# EAGLE board stm32_03.2 (EAGLE 9.5.1)
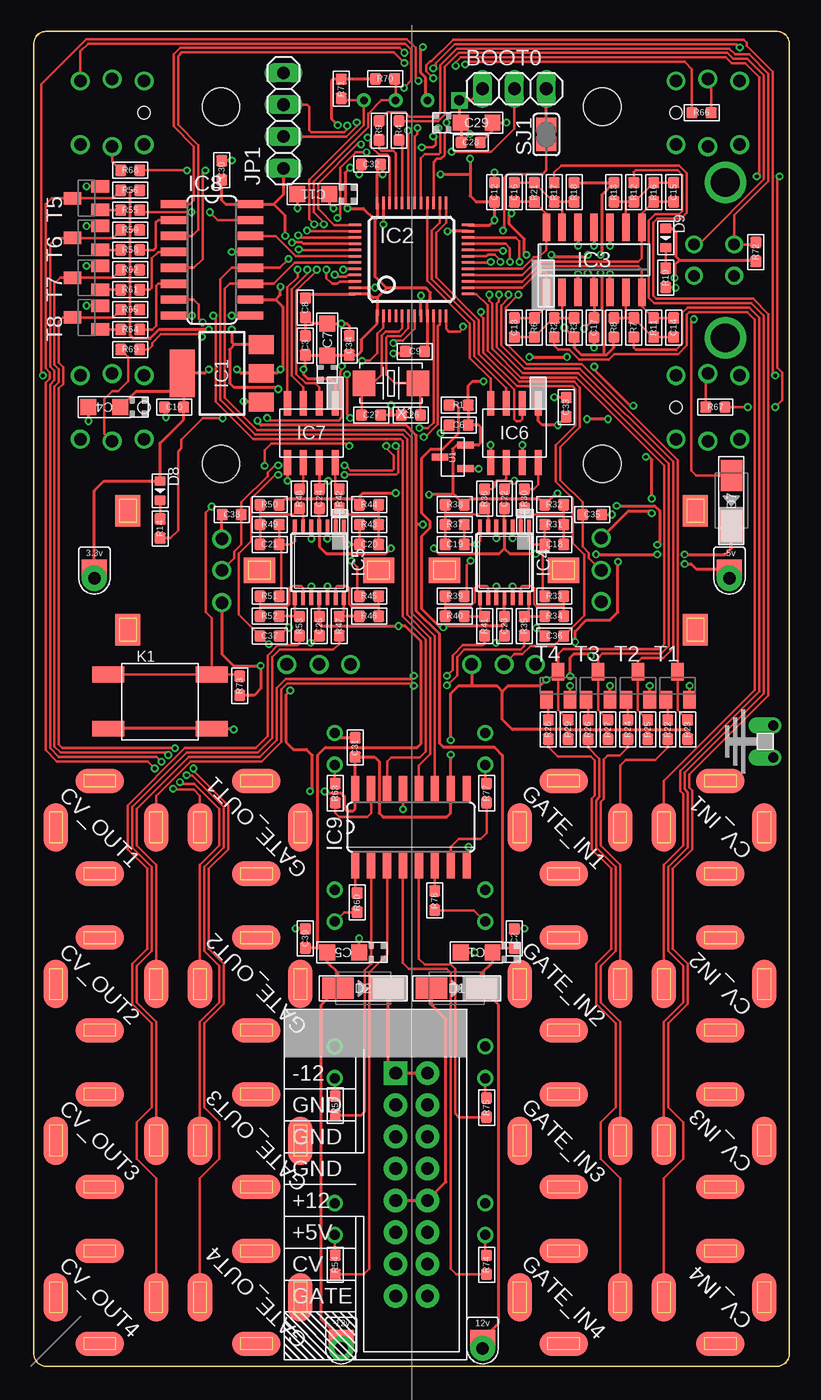
[diagram p4: board, top side]
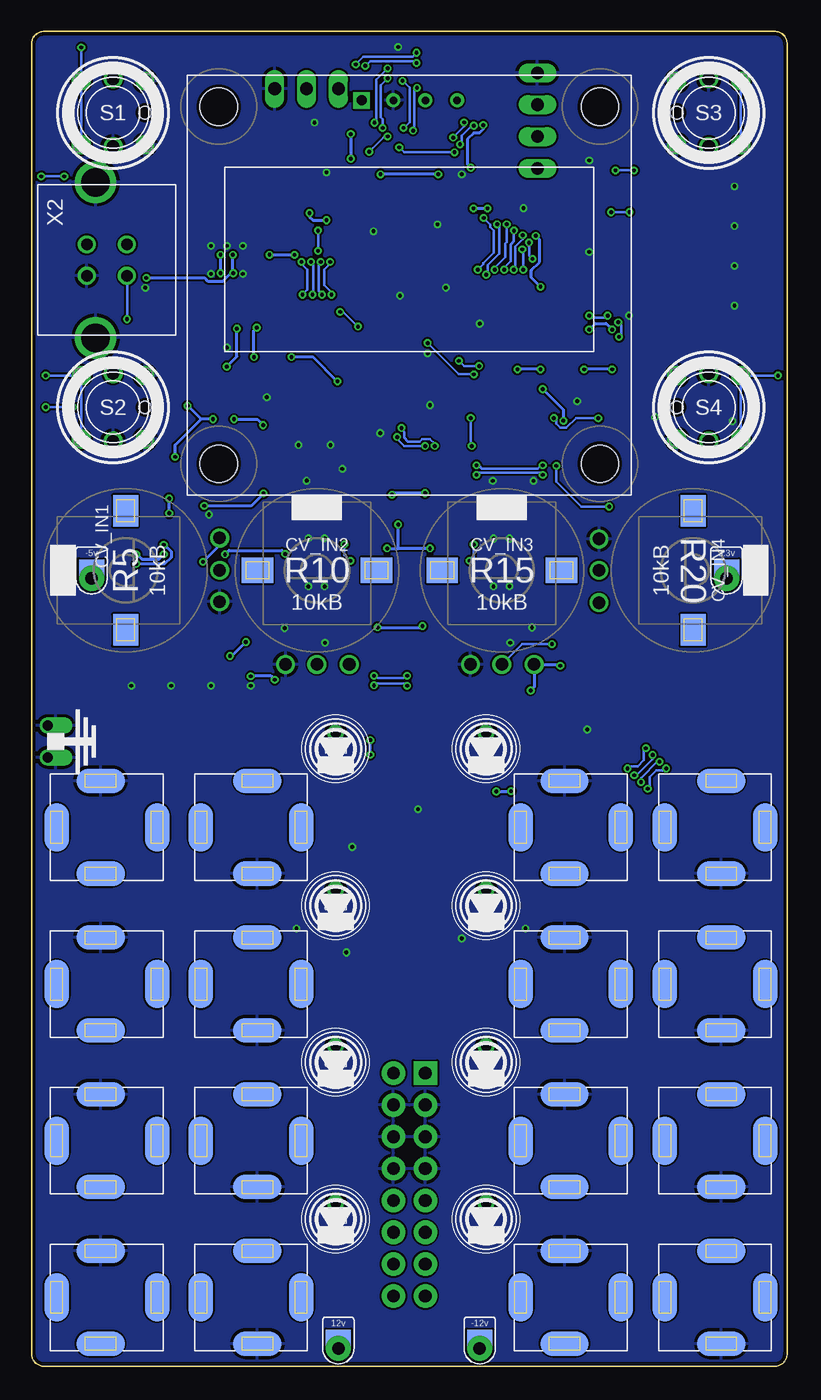
[diagram p5: board, bottom side, seen from below]

Size 60.25 x 106.5 mm. Coordinates in mm from the lower left corner, seen from the top.
Copper layers (1*16): Top 0.035mm / dielectric 1.5mm / Bottom 0.035mm
Design rules "ITeadstudio": minimum track width 6mil, minimum drill 12mil, track to track 6mil, track to pad 6mil, pad to pad 6mil, via to via 6mil, smd to smd 0mil, copper to edge 10mil, drill to drill 10mil, minimum pad ring 10mil, minimum via ring 6mil, stop-mask expansion 2mil, vias tented up to drill 100mil, thermal gap 10mil
Net classes: 0 default: width 0.203 mm; 1 POWER: width 0.254 mm

## Footprints (pad centres in the part's own frame; a part is rotated, then mirrored left to right if it is on the bottom)
1X03 = drill 1.016 long: 1 -2.54,0; 2 0,0; 3 2.54,0
CASE-A_3216 = smd 1.27 x 1.27: + -1.27,0; - 1.27,0
C0603 = smd 0.889 x 0.889: 1 -0.762,0; 2 0.762,0
DO-214AC = smd 2.5 x 1.7: 1 -2,0; 2 2,0
3MMLED = drill 0.8: + -1.27,0; - 1.27,0
LED0603 = smd 0.762 x 0.889: + -0.762,0; - 0.762,0
SOT223 = smd 1.5 x 2: 1 -2.3,-3.15; 2 0,-3.15; 3 2.3,-3.15 | smd 3.8 x 2: 4 0,3.15
TQFP48 = smd 0.2 x 1: 1 -2.75,-4.5; 2 -2.25,-4.5; 3 -1.75,-4.5; 4 -1.25,-4.5; 5 -0.75,-4.5; 6 -0.25,-4.5; 7 0.25,-4.5; 8 0.75,-4.5; 9 1.25,-4.5; 10 1.75,-4.5; 11 2.25,-4.5; 12 2.75,-4.5; 25 2.75,4.5; 26 2.25,4.5; 27 1.75,4.5; 28 1.25,4.5; 29 0.75,4.5; 30 0.25,4.5; 31 -0.25,4.5; 32 -0.75,4.5; 33 -1.25,4.5; 34 -1.75,4.5; 35 -2.25,4.5; 36 -2.75,4.5 | smd 1 x 0.2: 13 4.5,-2.75; 14 4.5,-2.25; 15 4.5,-1.75; 16 4.5,-1.25; 17 4.5,-0.75; 18 4.5,-0.25; 19 4.5,0.25; 20 4.5,0.75; 21 4.5,1.25; 22 4.5,1.75; 23 4.5,2.25; 24 4.5,2.75; 37 -4.5,2.75; 38 -4.5,2.25; 39 -4.5,1.75; 40 -4.5,1.25; 41 -4.5,0.75; 42 -4.5,0.25; 43 -4.5,-0.25; 44 -4.5,-0.75; 45 -4.5,-1.25; 46 -4.5,-1.75; 47 -4.5,-2.25; 48 -4.5,-2.75
SO14 = smd 0.6 x 2.2: 1 -3.81,-2.6; 2 -2.54,-2.6; 3 -1.27,-2.6; 4 0,-2.6; 5 1.27,-2.6; 6 2.54,-2.6; 7 3.81,-2.6; 8 3.81,2.6; 9 2.54,2.6; 10 1.27,2.6; 11 0,2.6; 12 -1.27,2.6; 13 -2.54,2.6; 14 -3.81,2.6
TSSOP14 = smd 0.305 x 0.991: 1 -1.95,-2.918; 2 -1.3,-2.918; 3 -0.65,-2.918; 4 0,-2.918; 5 0.65,-2.918; 6 1.3,-2.918; 7 1.95,-2.918; 8 1.95,2.918; 9 1.3,2.918; 10 0.65,2.918; 11 0,2.918; 12 -0.65,2.918; 13 -1.3,2.918; 14 -1.95,2.918
SOIC8-N_MC = smd 1.981 x 0.559: 1 -2.362,1.905; 2 -2.362,0.635; 3 -2.362,-0.635; 4 -2.362,-1.905; 5 2.362,-1.905; 6 2.362,-0.635; 7 2.362,0.635; 8 2.362,1.905
SO16 = smd 0.66 x 2.032: 1 -4.445,-3.073; 2 -3.175,-3.073; 3 -1.905,-3.073; 4 -0.635,-3.073; 5 0.635,-3.073; 6 1.905,-3.073; 7 3.175,-3.073; 8 4.445,-3.073; 9 4.445,3.073; 10 3.175,3.073; 11 1.905,3.073; 12 0.635,3.073; 13 -0.635,3.073; 14 -1.905,3.073; 15 -3.175,3.073; 16 -4.445,3.073
POWER_16_SHROUDED = drill 1.016 pad 1.88 square: 1 -8.89,-1.27 | drill 1.016 pad 1.88: 2 -8.89,1.27; 3 -6.35,-1.27; 4 -6.35,1.27; 5 -3.81,-1.27; 6 -3.81,1.27; 7 -1.27,-1.27; 8 -1.27,1.27; 9 1.27,-1.27; 10 1.27,1.27; 11 3.81,-1.27; 12 3.81,1.27; 13 6.35,-1.27; 14 6.35,1.27; 15 8.89,-1.27; 16 8.89,1.27
3.5MM-JACK-SWITCH-13MM-NOHOLES = smd 1.95 x 3.85 bottom: RING_B@1 -3.7,0; SWITCH_B@1 3.7,0 | smd 1.95 x 3.85: RING_T@3 -3.7,0; SWITCH_T@3 3.7,0 | smd 3.85 x 1.95 bottom: SECOND_B@1 0,-3.5; TIP_B@1 0,4.5 | smd 3.85 x 1.95: SECOND_T@3 0,-3.5; TIP_T@3 0,4.5
1X04 = drill 1.016 long: 1 -3.81,0; 2 -1.27,0; 3 1.27,0; 4 3.81,0
4P-SMD-6.0X6.0X5.0H = smd 2.54 x 1.27: 1 -4.129,2.159; 2 -4.129,-2.159; 3 4.129,-2.159; 4 4.129,2.159
R0603 = smd 0.889 x 0.889: 1 -0.762,0; 2 0.762,0
ALPS_POT_SQUAREHOLES = drill 1: P$1 -2.5,-7.5; P$2 0,-7.5; P$3 2.58,-7.5 | smd 2.5 x 2: P$4 -4.75,0; P$5 4.75,0 | smd 2.5 x 2 bottom: P$6 -4.75,0; P$7 4.75,0
PB6149L = drill 1: 1 2.54,2.54; 2 2.54,-2.54; 3 -2.54,2.54; 4 -2.54,-2.54; LEDNEG 0,-2.7; LEDPOS 0,2.7 | hole 1: 2.54,0
SJ = smd 1.168 x 1.6: 1 -0.762,0; 2 0.762,0
SOT23-BEC = smd 1 x 1.4: B -0.95,-1.1; C 0,1.1; E 0.95,-1.1
SOT95P237X112-3N = smd 1.321 x 0.559: 1 -1.016,0.94; 2 -1.016,-0.94; 3 1.016,0
POWERTESTPAD = drill 1 pad 2: P$1 0,0 | smd 2 x 1.5: P$2 0,-0.75 | smd 2 x 1.5 bottom: P$3 0,-0.75
1.3_4PIN_OLED_DRILLS = drill 0.8 square: P$1 -3.81,0 | drill 0.6: P$2 -1.27,0; P$3 1.27,0; P$4 3.81,0 | hole 3: -15.2,-0.5; 15.2,-0.5; -15.2,-29; 15.2,-29
GROUNDLOOP = drill 0.8 offset: P$1 1.27,0; P$2 -1.27,0
2P-SMD-5.0X3.2 = smd 1.778 x 2.032: 1 -2.159,0; 2 2.159,0
USB_B_VERT = drill 0.92: 1 1.25,1.6; 2 -1.25,1.6; 3 -1.25,-1.6; 4 1.25,-1.6 | drill 2.3: G1 -6.2,-0.9; G2 6.2,-0.9

## Placement (x,y rotation side)
BOOT0  [1X03]  38.33,101.92 0 top
C1  10uF  [CASE-A_3216]  35.31,33.02 180 top
C2  100nF  [C0603]  38.33,34.13 270 top
C3  100nF  [C0603]  21.66,81.44 270 top
C4  10uF  [CASE-A_3216]  5.62,76.52 180 top
C5  10uF  [CASE-A_3216]  24.67,33.02 180 top
C6  100nF  [C0603]  33.88,75.09 0 top
C7  10uF  [CASE-A_3216]  23.4,81.92 90 top
C8  100nF  [C0603]  21.66,84.45 90 top
C9  100nF  [C0603]  30.39,80.96 0 top
C10  100nF  [C0603]  11.18,76.52 0 top
C11  10uF  [CASE-A_3216]  22.29,93.5 180 top
C12  100nF  [C0603]  36.74,93.66 270 top
C13  3.3nF  [C0603]  38.33,82.87 90 top
C14  3.3nF  [C0603]  51.03,82.87 90 top
C15  3.3nF  [C0603]  51.03,93.66 270 top
C16  3.3nF  [C0603]  38.33,93.66 270 top
C17  100nF  [C0603]  44.68,82.87 90 top
C18  3.3nF  [C0603]  41.5,65.56 180 top
C19  3.3nF  [C0603]  33.56,65.56 0 top
C20  3.3nF  [C0603]  26.74,65.56 180 top
C21  3.3nF  [C0603]  18.8,65.56 0 top
C22  100nF  [C0603]  37.53,69.22 90 top
C23  100nF  [C0603]  37.53,59.05 90 top
C24  100nF  [C0603]  22.77,69.22 90 top
C25  100nF  [C0603]  22.77,59.05 90 top
C26  20pF  [C0603]  30.07,75.88 180 top
C27  20pF  [C0603]  26.9,75.88 0 top
C28  100nF  [C0603]  34.83,97.63 180 top
C29  10uF  [CASE-A_3216]  35.31,99.22 0 top
C30  100nF  [C0603]  14.99,95.41 270 top
C31  100nF  [C0603]  25.63,49.37 270 top
C32  100nF  [C0603]  26.9,95.89 0 top
C33  100nF  [C0603]  42.45,76.52 90 top
C34  100nF  [C0603]  25.15,81.44 90 top
C35  100nF  [C0603]  44.52,67.94 180 top
C36  100nF  [C0603]  41.5,58.26 0 top
C37  100nF  [C0603]  18.8,58.26 180 top
C38  100nF  [C0603]  15.78,67.94 0 top
C39  100nF  [C0603]  21.66,34.13 270 top
D1  [DO-214AC]  33.72,30.16 0 top
D2  [DO-214AC]  26.26,30.16 0 top
D3  [3MMLED]  24,11.75 270 bottom
D4  [3MMLED]  24,24.25 270 bottom
D5  [3MMLED]  24,36.75 270 bottom
D6  [3MMLED]  24,49.25 270 bottom
D7  [DO-214AC]  55.63,69.06 270 top
D8  RED  [LED0603]  10.07,69.85 270 top
D9  RED  [LED0603]  50.39,90.01 270 top
D11  [3MMLED]  36,11.75 270 bottom
D12  [3MMLED]  36,24.25 270 bottom
D13  [3MMLED]  36,36.75 270 bottom
D14  [3MMLED]  36,49.25 270 bottom
IC1  LD1117AS33TR  [SOT223]  14.99,79.22 90 top
IC2  STM32F10XCXT6  [TQFP48]  30.12,88.3 0 top
IC3  MCP6004  [SO14]  44.68,88.27 0 top
IC4  TL074TSSOP14  [TSSOP14]  37.53,64.14 180 top
IC5  TL074TSSOP14  [TSSOP14]  22.77,64.14 180 top
IC6  MCP4822-E/SN  [SOIC8-N_MC]  38.33,74.45 270 top
IC7  MCP4822-E/SN  [SOIC8-N_MC]  22.13,74.45 270 top
IC8  74HC595D  [SO16]  14.2,88.27 270 top
IC9  74HC595D  [SO16]  30.07,43.02 0 top
J1  POWERSHROUDED  [POWER_16_SHROUDED]  30.12,14.5 270 top
J2  JACK  [3.5MM-JACK-SWITCH-13MM-NOHOLES]  54.75,43 270 bottom
J3  JACK  [3.5MM-JACK-SWITCH-13MM-NOHOLES]  54.75,30.5 270 bottom
J4  JACK  [3.5MM-JACK-SWITCH-13MM-NOHOLES]  54.75,18 270 bottom
J5  JACK  [3.5MM-JACK-SWITCH-13MM-NOHOLES]  54.75,5.5 270 bottom
J6  JACK  [3.5MM-JACK-SWITCH-13MM-NOHOLES]  42.25,43 90 bottom
J7  JACK  [3.5MM-JACK-SWITCH-13MM-NOHOLES]  42.25,30.5 90 bottom
J8  JACK  [3.5MM-JACK-SWITCH-13MM-NOHOLES]  42.25,18 90 bottom
J9  JACK  [3.5MM-JACK-SWITCH-13MM-NOHOLES]  42.25,5.5 90 bottom
J10  JACK  [3.5MM-JACK-SWITCH-13MM-NOHOLES]  5.25,43 90 bottom
J11  JACK  [3.5MM-JACK-SWITCH-13MM-NOHOLES]  5.25,30.5 90 bottom
J12  JACK  [3.5MM-JACK-SWITCH-13MM-NOHOLES]  5.25,18 90 bottom
J13  JACK  [3.5MM-JACK-SWITCH-13MM-NOHOLES]  5.25,5.5 90 bottom
J14  JACK  [3.5MM-JACK-SWITCH-13MM-NOHOLES]  17.75,43 270 bottom
J15  JACK  [3.5MM-JACK-SWITCH-13MM-NOHOLES]  17.75,30.5 270 bottom
J16  JACK  [3.5MM-JACK-SWITCH-13MM-NOHOLES]  17.75,18 270 bottom
J17  JACK  [3.5MM-JACK-SWITCH-13MM-NOHOLES]  17.75,5.5 270 bottom
JP1  [1X04]  19.91,99.38 90 top
K1  BUTTON-4P-3100010P1  [4P-SMD-6.0X6.0X5.0H]  10.07,53.02 0 top
PCB1  EURORACK_PCB12HP  [EURORACK12HPPCB]  -0.25,0 0 top
R1  10k  [R0603]  33.88,76.68 0 top
R2  100k  [R0603]  41.5,82.87 90 top
R3  100k  [R0603]  43.09,82.87 90 top
R4  20r  [R0603]  29.12,98.58 270 top
R5  10kB  [ALPS_POT_SQUAREHOLES]  52.75,63.5 90 bottom
R6  33k  [R0603]  39.91,82.87 90 top
R7  100k  [R0603]  47.85,82.87 90 top
R8  51k  [R0603]  46.26,82.87 90 top
R9  20r  [R0603]  27.53,98.58 270 top
R10  10kB  [ALPS_POT_SQUAREHOLES]  37.5,63.5 0 bottom
R11  33k  [R0603]  49.44,82.87 90 top
R12  100k  [R0603]  47.85,93.66 270 top
R13  51k  [R0603]  46.26,93.66 270 top
R14  560r  [R0603]  10.07,66.83 90 top
R15  10kB  [ALPS_POT_SQUAREHOLES]  22.75,63.5 0 bottom
R16  33k  [R0603]  49.44,93.66 270 top
R17  100k  [R0603]  41.5,93.66 270 top
R18  51k  [R0603]  43.09,93.66 270 top
R19  560r  [R0603]  50.39,86.84 90 top
R20  10kB  [ALPS_POT_SQUAREHOLES]  7.5,63.5 270 bottom
R21  33k  [R0603]  39.91,93.66 270 top
R22  100k  [R0603]  50.55,50.8 90 top
R23  10k  [R0603]  52.14,50.8 270 top
R24  100k  [R0603]  47.38,50.8 90 top
R25  10k  [R0603]  48.96,50.8 270 top
R26  100k  [R0603]  44.2,50.8 90 top
R27  10k  [R0603]  45.79,50.8 270 top
R28  100k  [R0603]  41.02,50.8 90 top
R29  10k  [R0603]  42.61,50.8 270 top
R30  12k  [R0603]  39.12,69.22 270 top
R31  30k  [R0603]  41.5,67.15 180 top
R32  1m  [R0603]  41.5,68.74 0 top
R33  100k  [R0603]  41.5,61.44 0 top
R34  100k  [R0603]  41.5,59.85 180 top
R35  100r  [R0603]  39.12,59.05 270 top
R36  12k  [R0603]  35.95,69.22 270 top
R37  30k  [R0603]  33.56,67.15 0 top
R38  1m  [R0603]  33.56,68.74 180 top
R39  100k  [R0603]  33.56,61.44 180 top
R40  100k  [R0603]  33.56,59.85 0 top
R41  100r  [R0603]  35.95,59.05 270 top
R42  12k  [R0603]  24.36,69.22 270 top
R43  30k  [R0603]  26.74,67.15 180 top
R44  1m  [R0603]  26.74,68.74 0 top
R45  100k  [R0603]  26.74,61.44 0 top
R46  100k  [R0603]  26.74,59.85 180 top
R47  100r  [R0603]  24.36,59.05 270 top
R48  12k  [R0603]  21.18,69.22 270 top
R49  30k  [R0603]  18.8,67.15 0 top
R50  1m  [R0603]  18.8,68.74 180 top
R51  100k  [R0603]  18.8,61.44 180 top
R52  100k  [R0603]  18.8,59.85 0 top
R53  100r  [R0603]  21.18,59.05 270 top
R54  56r  [R0603]  24.04,8.1 270 top
R55  100k  [R0603]  7.69,92.23 0 top
R56  10k  [R0603]  7.69,93.82 0 top
R57  56r  [R0603]  24.04,20.8 270 top
R58  100k  [R0603]  7.69,89.06 0 top
R59  10k  [R0603]  7.69,90.65 0 top
R60  56r  [R0603]  25.79,36.99 90 top
R61  100k  [R0603]  7.69,85.88 0 top
R62  10k  [R0603]  7.69,87.47 0 top
R63  56r  [R0603]  24.04,45.72 270 top
R64  100k  [R0603]  7.69,82.71 0 top
R65  10k  [R0603]  7.69,84.3 0 top
R66  56r  [R0603]  53.25,100.01 180 top
R67  56r  [R0603]  54.36,76.52 0 top
R68  56r  [R0603]  7.69,95.41 0 top
R69  56r  [R0603]  7.69,81.12 0 top
R70  2k  [R0603]  28.01,102.71 0 top
R71  2k  [R0603]  24.52,101.92 270 top
R72  1.5k  [R0603]  57.58,88.9 270 top
R73  10k  [R0603]  16.42,54.29 270 top
R74  56r  [R0603]  36.1,8.1 270 top
R75  56r  [R0603]  36.1,20.64 270 top
R76  56r  [R0603]  31.98,37.15 90 top
R77  56r  [R0603]  36.1,45.72 270 top
S1  SWITCH_W_LED_PB6149L-X-102BLUE  [PB6149L]  53.75,100 0 bottom
S2  SWITCH_W_LED_PB6149L-X-102BLUE  [PB6149L]  53.75,76.5 0 bottom
S3  SWITCH_W_LED_PB6149L-X-102BLUE  [PB6149L]  6.25,100 180 bottom
S4  SWITCH_W_LED_PB6149L-X-102BLUE  [PB6149L]  6.25,76.5 180 bottom
SJ1  [SJ]  40.87,98.27 90 top
T1  [SOT23-BEC]  51.34,54.29 0 top
T2  [SOT23-BEC]  48.17,54.29 0 top
T3  [SOT23-BEC]  44.99,54.29 0 top
T4  [SOT23-BEC]  41.82,54.29 0 top
T5  [SOT23-BEC]  4.2,93.19 90 top
T6  [SOT23-BEC]  4.2,90.01 90 top
T7  [SOT23-BEC]  4.2,86.84 90 top
T8  [SOT23-BEC]  4.2,83.66 90 top
U1  LM4040DIM3-5.0  [SOT95P237X112-3N]  33.41,72.55 180 top
U$7  VOLTAGETESTPAD  [POWERTESTPAD]  35.79,1.43 180 top
U$8  VOLTAGETESTPAD  [POWERTESTPAD]  24.52,1.43 180 top
U$37  VOLTAGETESTPAD  [POWERTESTPAD]  4.83,62.87 180 top
U$38  VOLTAGETESTPAD  [POWERTESTPAD]  55.47,62.87 180 top
U$44  4PIN_OLED_DRILLS  [1.3_4PIN_OLED_DRILLS]  30.12,101 0 bottom
U$59  GNDLOOP  [GROUNDLOOP]  58.96,49.85 270 top
X1  CRYSTAL-0500290P1  [2P-SMD-5.0X3.2]  28.48,78.42 180 top
X2  USB_B_FEMALE_VERT  [USB_B_VERT]  54.25,88.25 270 bottom

## Tracks (layer width: path | path; a pad name or v marks a point on that pad's centre or on a via)
3.3V  (via drill 0.3)
  Top 0.254: IC2.24 36.35,91.05 v36.74,91.44 C12.2 35.28,92.9 34.8,93.38 34.8,95.09 | 27.38,95.09 IC2.36 27.38,91.6 27.21,91.44 | 27.38,95.09 27.38,95.6 C32.2 | R29.2 42.61,50.64 | 42.61,50.64 42.77,50.8 45.79,50.8 | 45.79,50.8 48.96,50.8 | 48.96,50.8 51.98,50.8 52.14,50.64 R23.2 | R25.2 48.96,50.8 | R27.2 45.79,50.8 | v13.96,79.53 13.64,79.22 IC1.4 11.94,79.11 11.94,77.79 | v16.19,79.53 16.51,79.22 IC1.2 19.35,79.22 v19.67,79.53 19.85,79.71 19.85,84.52 19.28,85.09 | IC7.1 24.04,78.42 23.66,78.8 21.84,78.8 21.5,79.15 v21.5,79.53 21.66,79.69 C3.2 23.37,80.68 C7.+ 23.44,80.68 C34.1 25.82,80.68 26.11,80.97 26.11,81.89 27.38,83.17 IC2.1 27.38,85.25 | IC8.10 19.28,85.09 | 19.12,92.71 IC8.16 15.31,92.71 14.99,93.03 C30.2 | JP1.1 19.91,93.5 19.12,92.71 | R70.1 24.55,102.71 R71.1 23.85,102.68 23.72,102.55 23.72,99.53 v24.23,99.02 | 28.12,86 31.28,86 31.62,85.66 31.62,85.18 31.38,84.93 IC2.9 31.38,81.19 C9.2 | 28.12,86 27.38,85.25 | 19.28,85.09 19.67,85.48 v19.67,86.12 | v20.05,90.19 20.05,91.78 19.12,92.71 | BOOT0.1 34.87,101 U$44.P$1 33.94,99.32 C29.+ 34.07,99.19 C28.2 34.74,98.3 v34.8,98.3 | C33.1 v41.79,75.09 40.55,75.09 40.23,75.41 IC6.1 | 27.21,91.44 27.21,86.91 28.12,86 | v34.8,96.34 34.8,95.09 | C11.+ 23.56,92.7 v23.89,92.37 | C8.2 21.99,85.55 IC2.48 26.75,85.55 27.05,85.25 27.38,85.25 | R73.2 17.56,53.53 18.09,54.06 v18.09,55.88 15.94,55.88 15,56.82 R20.P$3 | v20.45,53.92 20.09,53.57 20.09,49.82 20.7,49.21 21.73,49.21 22.2,48.74 22.2,46.06 v22.03,45.88 | v23.19,45.86 23.33,45.72 24.52,45.72 24.76,45.47 24.76,44.52 24.99,44.29 25.47,44.29 25.63,44.45 IC9.16 C31.2 27.18,48.61 27.53,48.26 27.53,44.13 27.85,43.81 32.93,43.81 33.25,44.13 IC9.10 v33.25,48.79
  Top 0.254: 42.61,50.64 42.45,50.8 38.17,50.8 37.37,51.59 37.37,53.82 | 37.37,53.82 36.9,54.29 34.99,54.29 | D9.+ 50.9,90.77 51.19,90.49 51.19,88.58 51.5,88.27 | R72.2 57.46,88.27 51.5,88.27 | 51.5,88.27 51.12,87.88 51.12,86.85 v51.1,86.84 | v44.17,87.2 44.33,87.2 44.68,86.85 IC3.4 C17.2 44.68,83.58 v43.88,82.78 | v25.23,95.62 24.83,95.22 24.83,92.55 v25.01,92.37 26.28,92.37 27.21,91.44 | v44.2,88.68 44.02,88.5 41.45,88.5 v41.27,88.68 | v39.29,88.67 39.11,88.84 39.11,89.92 37.91,91.12 37.91,91.82 v38.09,92 | 27.38,95.09 v27.82,95.09 | v32.43,95.09 34.8,95.09 | 37.37,53.82 37.85,54.29 40.38,54.29 v40.86,54.77 | v42.78,55.05 42.78,56.53 43.09,56.84 44.26,56.84 v44.44,56.67 | v43.16,57.78 43.16,58.62 44.07,59.53 45.95,59.53 46.58,60.17 v46.58,64.19 | R5.P$3 47.41,68.24 49.1,68.24 v49.27,68.06 | v49.28,69.23 49.28,72.33 49.01,72.6 48.85,72.6 v48.8,72.55 | v45.79,75.57 v44.11,75.57 v44.11,75.56 | v47.81,76.64 47.56,76.64 44.69,79.5 v44.69,79.76 | v33.25,49.95 33.25,53.66 33.88,54.29 34.99,54.29 | 34.99,54.29 34.92,54.37 R10.P$3 | 11.94,77.79 C10.2 11.94,75.53 10.07,73.66 D8.+ 5.59,70.61 4.83,69.85 U$37.P$3 | C4.+ 8.16,77.79 11.94,77.79
  Bottom 0.254: v13.96,79.53 v16.19,79.53 | v19.67,79.53 v21.5,79.53 | v19.67,86.12 20.39,86.84 20.39,87.44 19.73,88.1 19.73,89.86 v20.05,90.19 | v34.8,98.3 v34.8,96.34 | v23.89,92.37 v25.01,92.37 | v18.09,55.88 18.21,56 R15.P$3 20.17,54.2 v20.45,53.92 | v23.19,45.86 22.05,45.86 v22.03,45.88 | v51.1,86.84 46.45,86.84 46.19,86.57 44.99,86.57 44.36,87.2 v44.17,87.2 44.2,87.23 v44.2,88.68 | v24.23,99.02 24.23,98.71 24.55,98.39 24.99,98.39 25.51,97.88 25.51,95.9 v25.23,95.62 | v41.27,88.68 v39.3,88.68 v39.29,88.67 | v38.09,92 38.09,91.68 37.85,91.44 v36.74,91.44 | v27.82,95.09 v32.43,95.09 | v40.86,54.77 41.15,55.05 v42.78,55.05 | v44.44,56.67 44.28,56.67 v43.16,57.78 | v46.58,64.19 45.25,65.52 R5.P$3 | v49.27,68.06 v49.27,69.22 v49.28,69.23 | v48.8,72.55 48.8,73.5 46.74,75.57 | v45.79,75.57 46.74,75.57 | v44.11,75.56 42.26,75.56 v41.79,75.09 | 46.74,75.57 v47.81,76.64 | v44.69,79.76 43.88,80.56 v43.88,82.78 | v33.25,48.79 v33.25,49.95
5V  (via drill 0.3)
  Top 0.203: D7.1 52.84,71.06 52.44,71.46 52.44,83.34 v52.64,83.54
  Bottom 0.203: v52.64,83.54 X2.1
12V  (via drill 0.3)
  Top 0.254: 7.69,84.3 7.69,82.25 7.95,81.98 9.25,81.98 9.97,82.71 v13.96,82.71 | 7.69,84.3 7.69,87.47 | 7.69,87.47 7.69,90.65 | 7.69,90.65 7.69,93.66 7.85,93.82 R56.2 | R59.2 7.69,90.65 | R62.2 7.69,87.47 | C24.1 IC5.4 22.77,65.41 23.33,64.84 28.08,64.84 v28.48,65.25 | C22.1 IC4.4 37.53,65.25 | 37.53,65.25 37.13,64.84 32.31,64.84 v31.9,65.25 | v31.9,65.25 | 30.52,67.15 30.52,60.26 32.36,58.42 32.36,49.69 32.67,49.37 36.74,49.37 37.37,48.74 37.37,33.37 | 30.52,67.15 30.52,74.26 29.71,75.07 18.11,75.07 17.84,75.34 v17.84,75.44 | R65.2 7.69,84.3 | v44.83,64.77 v49.72,64.77 | v51.9,64.77 55.15,64.77 55.63,65.25 D7.2 | v31.02,67.15 30.52,67.15 | v40.02,64.81 39.99,64.84 37.94,64.84 37.53,65.25 | U$7.P$3 37.06,3.45 37.06,28.83 D1.2 35.72,31.37 36.58,32.23 C1.+ 36.93,33.37 37.37,33.37 | 37.37,33.37 C2.2 | IC1.3 16,81.52 | 16,81.52 15.61,81.12 15.61,78.44 15.94,78.11 19.35,78.11 v19.49,77.96 | v15.78,82.71 15.78,81.73 16,81.52
  Bottom 0.254: v28.48,65.25 31.02,65.25 | v15.78,82.71 15.31,83.19 14.43,83.19 v13.96,82.71 | 31.02,65.25 v31.02,67.15 | v31.9,65.25 31.02,65.25 | v44.83,64.77 44.51,65.09 40.3,65.09 v40.02,64.81 | v51.9,64.77 51.82,64.77 51.46,64.41 50.07,64.41 v49.72,64.77 | v19.49,77.96 17.84,76.31 v17.84,75.44
-5V  (via drill 0.3)
  Top 0.254: R8.1 46.26,81.28 45.68,80.7 45.47,80.7 | 45.47,80.7 43.67,80.7 43.09,81.28 R3.1 43.06,82.11 v42.3,82.87 | R50.1 20.04,69.22 25.5,69.22 R44.1 25.98,69.41 26.23,69.66 v28.86,69.66 | v45.18,87.2 45.31,87.08 45.31,84.3 45.47,84.14 45.47,80.7 | v35.86,78.57 35.85,78.58 34.99,78.58 34.64,78.23 R1.2 C6.2 35.47,75.09 35.63,74.93 35.63,73.66 35.46,73.49 U1.2 33.71,73.49 33.41,73.18 33.41,69.66 | v39.52,80.52 v42.52,80.52 | 33.41,69.66 R38.1 34.8,69.22 40.26,69.22 R32.1 41.64,69.64 v41.75,69.64 | v46.48,68.64 49.52,68.64 49.9,68.26 49.9,65.71 v49.72,65.53 | v51.9,64.01 52.42,64.01 52.82,63.62 U$38.P$3 | 33.41,69.66 33.28,69.53 v31.51,69.53 | R18.1 R13.1 45.31,93.47 45.31,88.8 v45.18,88.68
  Bottom 0.254: v45.18,87.2 v45.18,88.68 | v35.86,78.57 37.81,80.52 v39.52,80.52 | v42.52,80.52 42.52,82.64 v42.3,82.87 | v41.75,69.64 42.75,68.64 v46.48,68.64 | v49.72,65.53 49.54,65.35 49.48,65.35 49.13,65.01 49.13,64.53 49.65,64.01 v51.9,64.01 | v28.86,69.66 31.38,69.66 v31.51,69.53
-12V  (via drill 0.3)
  Top 0.254: IC5.11 C25.2 22.77,59.21 22.93,59.05 v29.08,59.05 29.64,59.05 30.88,57.81 30.88,49.69 30.57,49.37 23.25,49.37 22.61,48.74 22.61,33.37 | IC4.11 C23.2 37.53,59.21 37.37,59.05 32.76,59.05 v32.66,58.95 32.4,58.95 30.92,60.43 30.92,66.22 31.61,66.91 31.61,67.39 30.92,68.08 30.92,72.45 31.66,73.18 32.61,73.18 33.88,74.45 33.88,76.52 33.72,76.68 R1.1 | U$8.P$3 22.93,3.77 22.93,27.46 22.93,28.83 D2.1 24.26,31.37 23.4,32.23 C5.- 23.05,33.37 22.61,33.37 | 22.61,33.37 C39.2
  Bottom 0.254: v32.66,58.95 29.19,58.95 v29.08,59.05
BOOT0  (via drill 0.3)
  Top 0.203: IC2.44 24.73,87.55 v24.67,87.49 | BOOT0.2 38.33,98.74 36.49,96.9 v33.33,96.9 | v26.53,96.85 25.67,96.85 24.45,95.63 24.45,91.86 v24.2,91.61 | v30.93,97.24 31.82,97.24 32.06,97.47 32.06,97.9 v31.86,98.11
  Bottom 0.203: v24.67,87.49 24.24,87.93 24.24,88 23.41,88.84 23.41,90.6 23.68,90.88 23.68,91.09 v24.2,91.61 | v26.53,96.85 30.55,96.85 v30.93,97.24 | v31.86,98.11 32.12,98.11 v33.33,96.9
BOOT1  (via drill 0.3)
  Top 0.203: IC2.20 37.35,89.05 v37.41,88.99 | SJ1.1 40.87,95.41 40.58,95.12 37.84,95.12 37.53,94.81 37.53,90.73 v37.41,90.61
  Bottom 0.203: v37.41,88.99 v37.41,90.61
BTN_IN1  (via drill 0.3)
  Top 0.203: IC2.27 31.88,96.06 32.13,96.32 32.46,96.32 32.71,96.58 32.71,96.59 32.77,96.65 32.77,98.36 32.91,98.5 v32.91,99.21 | v56.29,105.21 56.02,105.49 33.59,105.49 32.06,103.96 32.06,103.75 v31.86,103.55
  Bottom 0.203: S1.4 S1.3 v56.29,105.21 | v32.91,99.21 32.77,99.35 32.77,102.63 v31.86,103.55
BTN_IN2  (via drill 0.3)
  Top 0.203: IC2.29 30.88,96.4 31.16,96.68 32.29,96.68 32.41,96.8 32.41,98.63 v32.25,98.79 | v31.86,102.76 31.3,103.31 31.3,103.78 31.62,104.11 31.7,104.11 33.44,105.84 56.61,105.84 56.85,105.6 56.85,105.36 58.92,103.28 58.92,79.24 v59.12,79.04
  Bottom 0.203: S2.4 S2.3 v59.12,79.04 | v32.25,98.79 32.25,99.5 32.41,99.66 32.41,102.2 v31.86,102.76
BTN_IN3  (via drill 0.3)
  Top 0.203: S3.4 3.71,104.9 4.34,105.53 29.61,105.53 30.11,105.03 30.11,102.58 v29.52,101.99 | IC2.31 29.88,98.54 v29.83,98.58
  Bottom 0.203: S3.4 S3.3 | v29.83,98.58 29.75,98.66 29.75,101.76 v29.52,101.99
BTN_IN4  (via drill 0.3)
  Top 0.203: v0.72,79.04 0.58,79.18 0.58,102.27 4.2,105.89 29.75,105.89 30.46,105.17 30.46,102.76 v30.67,102.55 | IC2.30 30.38,98.09 30.59,98.31 v30.59,98.79
  Bottom 0.203: S4.3 S4.4 v0.72,79.04 | v30.59,98.79 30.11,99.27 30.11,101.99 v30.67,102.55
CS1
  Top 0.203: IC2.25 32.88,91.22 32.09,90.44 32.09,86.89 35.49,83.48 35.49,80.74 38.33,77.91 38.33,75.56 38.48,75.41 38.8,75.41 38.96,75.56 IC6.2
CS2  (via drill 0.3)
  Top 0.203: IC2.38 21.84,90.55 v21.78,90.61 | IC7.2 22.77,78.11 22.45,78.42 21.68,78.42 20.94,79.17 20.94,85.8 22.56,87.42 v22.56,87.49
  Bottom 0.203: v21.78,90.61 21.78,89.75 22.04,89.49 22.04,88.17 22.56,87.65 v22.56,87.49
CV_IN1
  Top 0.203: IC2.14 38.97,86.05 40.23,87.31 40.71,87.31 40.87,87.15 IC3.1 40.87,84.58 R6.2 C13.2
CV_IN2
  Top 0.203: C14.2 R11.2 48.49,84.58 IC3.7 48.49,87.47 48.2,87.76 40.18,87.76 38.97,86.55 IC2.15
CV_IN3
  Top 0.203: C15.2 R16.2 48.49,91.95 IC3.8 48.49,88.39 48.22,88.12 40.03,88.12 38.96,87.05 IC2.16
CV_IN4
  Top 0.203: IC2.17 38.96,87.55 39.88,88.47 40.28,88.47 40.87,89.06 IC3.14 40.87,91.95 R21.2 C16.2
GATE_IN1  (via drill 0.3)
  Top 0.203: IC2.22 38.45,90.05 38.73,89.77 v38.73,88.11 | v38.64,85.49 37.63,84.47 37.63,81.62 39.29,79.96 43.7,79.96 51.34,72.31 T1.C 51.34,52.36 R23.1
  Bottom 0.203: v38.64,85.49 38.25,85.88 38.25,87.47 38.73,87.95 v38.73,88.11
GATE_IN2  (via drill 0.3)
  Top 0.203: IC2.21 37.64,89.55 37.97,89.22 v37.97,88.11 | v37.85,85.49 37.85,85.2 37.27,84.62 37.27,81.47 39.14,79.6 43.55,79.6 50.99,72.16 50.99,57.31 50.19,56.52 48.49,56.52 48.17,56.2 48.17,55.56 T2.C 48.17,52.36 R25.1
  Bottom 0.203: v37.85,85.49 37.81,85.54 37.81,87.95 v37.97,88.11
GATE_IN3  (via drill 0.3)
  Top 0.203: IC2.19 36.09,88.55 36.24,88.69 36.74,88.69 37.2,88.23 v37.2,88.11 | v37.09,85.49 37.09,84.94 36.92,84.77 36.92,81.33 38.99,79.25 43.4,79.25 50.63,72.02 50.63,57.47 50.04,56.87 45.35,56.87 44.99,56.52 T3.C 44.99,52.36 R27.1
  Bottom 0.203: v37.2,88.11 37.36,87.95 37.36,85.76 v37.09,85.49
GATE_IN4  (via drill 0.3)
  Top 0.203: IC2.18 36.38,88.05 v36.44,88.11 | v36.33,85.49 36.33,85.02 36.56,84.79 36.56,81.18 38.85,78.89 43.25,78.89 50.28,71.87 50.28,57.63 49.88,57.23 42.21,57.23 41.82,56.83 T4.C 41.82,52.36 R29.1
  Bottom 0.203: v36.44,88.11 36.44,87.95 36.92,87.47 36.92,86.24 36.33,85.65 v36.33,85.49
GATE_OUT1  (via drill 0.3)
  Top 0.203: v12.56,92.08 8.61,92.08 R55.2 | v14.04,92.08 14.67,91.44 IC8.15
  Bottom 0.203: v12.56,92.08 v14.04,92.08
GATE_OUT2
  Top 0.203: R58.2 9.57,89.06 9.74,89.23 9.74,91.27 9.91,91.44 IC8.2
GATE_OUT3
  Top 0.203: R61.2 9.24,85.88 9.4,86.04 9.4,88.39 9.91,88.9 IC8.4
GATE_OUT4
  Top 0.203: R64.2 9.43,82.71 9.75,83.03 9.75,86.2 9.91,86.36 IC8.6
GND  (via drill 0.3)
  Top 0.254: IC9.8 34.67,40.11 v34.67,41.43 | IC9.13 v29.44,44.45 | IC3.11 v44.68,89.38 | IC3.10 v45.95,89.38 | IC3.12 v43.41,89.38 | IC3.5 v45.95,87.15 | IC3.3 v43.41,87.15 | C17.1 v44.68,81.28 | IC2.23 v32.99,90.55 | IC2.35 v27.88,91.1 | IC2.47 v27.21,86.05 | IC2.8 v30.88,85.42 | IC4.10 v36.88,62.22 | IC4.12 v38.18,62.22 | IC4.5 v36.88,66.06 | IC4.3 v38.18,66.06 | C23.1 36.97,57.73 v36.85,57.73 | C25.1 22.2,57.73 v22.08,57.73 | IC5.10 22.13,61.23 v22.13,62.23 | IC5.12 v23.42,62.22 | IC7.7 C24.2 23.44,70.64 v23.48,70.64 | v36.42,73.5 IC6.5 | v38.96,73.5 IC6.7 | T8.E v4.2,84.61 | T7.E v4.2,87.79 | T6.E v4.2,90.96 | T5.E v4.2,94.14 | IC8.8 v12.61,83.82 | IC8.13 v15.78,88.9 | v37.69,99.22 C29.- 36.58,98.61 C28.1 | SJ1.2 BOOT0.3 | C26.2 28.48,75.88 | 28.48,75.88 C27.2 | 28.48,75.88 v28.48,76.68 | U$44.P$2 31.25,101.14 31.25,102.79 30.85,103.2 30.85,105.07 v31.02,105.25 | 34.41,71.6 U1.1 35.46,71.61 v35.47,71.6 | C22.2 38.2,70.65 v38.32,70.65 | C3.1 C8.1 22.17,83.19 C7.- v24.52,83.19 24.99,83.19 25.15,83.03 C34.2 | C30.1 15.02,96.2 v15.78,96.2 | C33.2 41.53,77.28 v41.5,77.31 | C35.1 v46.1,67.94 | C12.1 v36.74,95.25 | C11.- v21.02,92.39 | C32.1 26.13,95.28 v25.94,95.09 | IC7.5 v20.23,70.64 | K1.2 K1.3 15.88,50.86 v15.94,50.8 | T4.E v42.77,54.29 | T3.E v45.94,54.29 v45.95,54.29 | T2.E v49.12,54.29 | T1.E v52.3,54.29 | C36.1 40.1,58.9 v40.07,58.9 | R19.1 51.15,86.07 v51.19,86.04 | C6.1 32.48,74.45 v32.45,74.45 | C31.1 24.39,50.13 D6.+ | R20.P$1 15,67.92 C38.1 | C37.1 20.23,58.93 v20.35,58.93 | IC5.5 22.13,67.04 v22.13,66.04 | IC5.3 23.42,66.06 v23.4,66.04 | 25.75,33.21 C5.+ v25.94,34.13 | C39.1 21.63,34.92 v20.86,34.92 | C2.1 38.36,34.92 v39.12,34.92 | C1.- v35.15,33.02 | C4.- v4.35,75.41
  Top 0.254: C10.1 10.42,75.85 v10.54,75.72 | IC1.1 16.81,76.92 v16.74,76.99 | C9.1 29.47,80.8 v28.67,80.8
  pour Bottom: 60.55,108.58 62.62,106.52 62.62,-0.64 61.19,-2.06 0.39,-2.06 -2.47,0.79 -2.47,107.31
LED_BTN1  (via drill 0.3)
  Top 0.203: IC8.1 12.45,92.71 12.77,93.03 12.77,97.29 11.14,98.91 11.14,104.66 11.66,105.17 29.17,105.17 v29.55,104.8 | v34.4,103.86 34.61,104.06 51.9,104.06 52.49,103.47 R66.2
  Bottom 0.203: v29.55,104.8 29.87,104.48 33.78,104.48 v34.4,103.86
LED_BTN2  (via drill 0.3)
  Top 0.203: IC8.3 12.61,90.17 13.12,90.68 13.12,97.43 11.5,99.06 11.5,104.51 11.8,104.82 28.71,104.82 v29.55,103.98 | v33.64,103.75 33.64,104.03 34.03,104.42 55.16,104.42 55.64,103.94 56.75,103.94 57.85,102.84 57.85,95.13 v57.65,94.92 | R67.2 v56.94,76.52 | v59.12,76.52 59.68,77.08 59.68,79.27 59.27,79.68 59.27,94.72 v59.48,94.92
  Bottom 0.203: v29.55,103.98 29.69,104.12 33.26,104.12 v33.64,103.75 | v56.94,76.52 v59.12,76.52 | v57.65,94.92 v59.48,94.92
LED_BTN3  (via drill 0.3)
  Top 0.203: IC8.5 12.77,87.63 13.48,88.34 13.48,95.21 v13.68,95.41 | R68.2 v12.21,95.41
  Bottom 0.203: v12.21,95.41 v13.68,95.41
LED_BTN4  (via drill 0.3)
  Top 0.203: R69.2 9.12,81.12 9.43,81.44 9.43,81.63 10.13,82.33 13.2,82.33 v13.4,82.12 | IC8.7 12.77,85.09 13.17,84.69 13.17,83.59 v13.46,83.29
  Bottom 0.203: v13.4,82.12 13.24,82.28 13.24,83.08 v13.46,83.29
LED_IN1
  Top 0.203: IC9.7 33.25,41.43 33.88,42.07 35.63,42.07 36.1,42.55 R77.2
LED_IN2
  Top 0.203: R76.2 IC9.6
LED_IN3
  Top 0.203: R75.2 33.89,19.88 33.6,20.16 33.6,31.71 33.25,32.06 31.16,32.06 30.71,32.52 IC9.5
LED_IN4
  Top 0.203: R74.2 33.69,7.33 33.25,7.78 33.25,31.39 32.93,31.71 29.9,31.71 29.44,32.17 IC9.4
LED_OUT1
  Top 0.203: R63.2 24.04,44.13 24.36,43.81 26.58,43.81 26.9,44.13 IC9.15
LED_OUT2
  Top 0.203: R60.2 25.63,37.91 IC9.1
LED_OUT3
  Top 0.203: R57.2 26.1,20.03 26.38,20.32 26.38,31.58 26.9,32.09 IC9.2
LED_OUT4
  Top 0.203: R54.2 26.29,7.33 26.74,7.78 26.74,27.15 26.74,31.43 28.17,32.86 IC9.3
MOSI1
  Top 0.203: IC2.28 31.38,86.59 34.78,83.18 34.78,80.44 36.42,78.8 IC6.4
MOSI2  (via drill 0.3)
  Top 0.203: IC2.41 21.19,89.05 v21.13,89.11 | v21.04,87.49 21.04,86.91 20.23,86.1 IC7.4
  Bottom 0.203: v21.13,89.11 21.04,89.02 v21.04,87.49
N$1
  Top 0.254: J1.2 J1.1 28.26,23.98 D2.2
N$2
  Top 0.254: J1.9 J1.10 32.87,14.7 32.87,27.69 31.72,28.83 D1.1
N$3
  Top 0.203: R14.2 D8.-
N$4
  Top 0.203: J2.TIP_T@3 50.25,46.71 57.5,53.96 57.5,83.51 56.91,84.1 52.28,84.1 52.08,83.89 52.08,81.47 51.37,80.77 46.29,80.77 45.84,80.31 43.52,80.31 42.71,81.12 41.82,81.12 41.5,81.44 R2.1
N$5
  Top 0.203: C13.1 R6.1 41.44,83.63 R2.2 42.14,83.63 | 42.14,83.63 R3.2 | IC3.2 42.14,83.63
N$6
  Top 0.203: J7.TIP_T@3 46.75,39.99 45.2,41.54 45.2,45.01 45.46,45.26 45.46,48.41 45.79,48.74 46.74,48.74 47.38,49.37 R24.1
N$7  (via drill 0.3)
  Top 0.203: IC2.2 27.88,82.85 27.4,82.38 27.4,80.83 26.78,80.21 v26.18,80.21 | v24.56,79.8 24.56,79.51 24.42,79.37 24.42,78.06 24.57,77.91 24.57,75.72 24.3,75.45 18.81,75.45 v18.6,75.65 | R14.1 10.89,66.07 11.5,66.67 11.5,72.98 11.75,73.24 11.75,73.91 13.47,75.63 v15.06,75.63
  Bottom 0.203: v26.18,80.21 25.76,79.8 v24.56,79.8 | v15.06,75.63 15.08,75.65 16.83,75.65 17.61,74.88 18.07,74.88 18.4,75.2 18.4,75.45 v18.6,75.65
N$8
  Top 0.203: J3.TIP_T@3 50.25,39.99 51.8,41.54 51.8,45.64 51.54,45.9 51.54,47.5 57.85,53.81 57.85,83.66 57.06,84.45 52.14,84.45 51.73,84.04 51.73,81.62 51.23,81.12 48.01,81.12 47.85,81.28 R7.1
N$9
  Top 0.203: C14.1 R11.1 49.38,82.11 R7.2 47.22,83.63 | 47.22,83.63 R8.2 | IC3.6 47.22,83.63
N$10
  Top 0.203: R24.2 47.38,53.04 T2.B
N$11
  Top 0.203: R19.2 D9.-
N$12
  Top 0.203: J4.TIP_T@3 50.25,27.49 51.8,29.04 51.8,31.96 50.61,33.15 50.61,39.85 52.15,41.39 52.15,45.79 51.9,46.04 51.9,47.36 58.21,53.67 58.21,83.81 57.21,84.81 49.49,84.81 49.04,85.26 49.04,91.39 49.57,91.92 51.47,91.92 51.73,92.17 51.73,95.03 51.34,95.41 48.01,95.41 47.85,95.25 R12.1
N$13
  Top 0.203: C15.1 R16.1 47.91,92.9 R12.2 47.22,92.9 | R13.2 47.22,92.9 | IC3.9 47.22,92.9
N$14
  Top 0.203: J8.TIP_T@3 46.75,27.49 45.2,29.04 45.2,31.96 46.39,33.15 46.39,39.85 44.85,41.39 44.85,45.15 45.1,45.41 45.1,48.47 44.2,49.37 R26.1
N$16
  Top 0.203: J5.TIP_T@3 50.25,14.99 51.8,16.54 51.8,19.46 50.61,20.65 50.61,27.35 52.15,28.89 52.15,32.11 50.96,33.3 50.96,39.7 52.51,41.25 52.51,45.94 52.25,46.19 52.25,47.21 58.56,53.52 58.56,83.96 57.35,85.17 49.64,85.17 49.4,85.41 49.4,91.24 49.72,91.56 51.62,91.56 52.08,92.02 52.08,95.17 51.47,95.79 42.04,95.79 41.5,95.25 R17.1
N$17
  Top 0.203: R18.2 42.14,92.9 | 42.14,92.9 R17.2 41.44,92.9 R21.1 C16.1 | IC3.13 42.14,92.9
N$18
  Top 0.203: R26.2 44.2,53.04 T3.B
N$19
  Top 0.203: J6.TIP_T@3 46.75,47.91 47.22,48.38 49.56,48.38 50.55,49.37 R22.1
N$20
  Top 0.203: R22.2 50.55,53.04 T1.B
N$21
  Top 0.203: J9.TIP_T@3 46.75,14.99 45.2,16.54 45.2,19.46 46.39,20.65 46.39,27.35 44.85,28.89 44.85,32.11 46.04,33.3 46.04,39.7 44.49,41.25 44.49,45.3 44.75,45.56 44.75,48.32 44.42,48.64 41.78,48.64 41.02,49.4 R28.1
N$22
  Top 0.203: R28.2 41.02,53.04 T4.B
N$23
  Top 0.203: R32.2 42.26,67.94 | 42.26,67.94 R31.1 C18.1 | IC4.2 38.83,68.17 R30.2 39.63,67.94 42.26,67.94
N$24
  Top 0.203: IC4.1 39.48,65.84 39.76,65.56 C18.2 | C18.2 R31.2 | R33.1 40.58,61.59 40.58,65.41 C18.2
N$25  (via drill 0.3)
  Top 0.203: J10.TIP_T@3 9.75,45.5 12.49,48.25 18.16,48.25 19.71,49.8 19.71,53.98 20.22,54.48 30.12,54.48 v30.3,54.3 | R35.2 39.12,57.47 38.82,57.17 34.34,57.17 33.75,56.58 33.75,55.11 32.97,54.32 v32.94,54.32
  Bottom 0.203: v30.3,54.3 30.46,54.45 32.81,54.45 v32.94,54.32
N$26
  Top 0.203: R33.2 42.26,60.64 | 42.26,60.64 R34.1 | 42.26,60.64 40.07,60.64 39.91,60.8 39.91,62.07 39.76,62.23 38.96,62.23 38.83,62.1 IC4.13
N$27
  Top 0.203: R34.2 40.71,59.82 R35.1 39.48,60.18 IC4.14
N$28
  Top 0.203: IC6.8 40.23,70.33 39.88,69.98 R30.1
N$29
  Top 0.203: R38.2 32.8,67.94 | 32.8,67.94 R37.1 C19.1 | IC4.6 36.23,68.17 R36.2 35.44,67.94 32.8,67.94
N$30  (via drill 0.3)
  Top 0.203: R37.2 C19.2 v35.31,65.56 35.58,65.84 IC4.7 | R39.1 34.52,61.63 34.52,63.94 v34.83,64.26
  Bottom 0.203: v34.83,64.26 35.31,64.73 v35.31,65.56
N$31
  Top 0.203: R40.1 32.8,60.64 | 32.8,60.64 R39.2 | IC4.9 36.23,62.1 36.1,62.23 35.31,62.23 35.15,62.07 35.15,60.96 34.83,60.64 32.8,60.64
N$32
  Top 0.203: R40.2 34.36,59.82 R41.1 35.58,60.18 IC4.8
N$33
  Top 0.203: R36.1 36.55,69.98 36.74,70.17 36.74,70.48 36.93,70.67 37.56,70.67 37.69,70.8 IC6.6
N$34  (via drill 0.3)
  Top 0.203: J11.TIP_T@3 9.75,39.99 8.2,41.54 8.2,44.46 12.35,48.6 18.01,48.6 19.36,49.95 19.36,54.12 20.07,54.83 30.05,54.83 v30.3,55.09 | R41.2 35.95,57.66 35.81,57.52 34.2,57.52 33.4,56.72 33.4,55.54 v32.94,55.09
  Bottom 0.203: v30.3,55.09 30.46,55.09 30.62,54.93 32.62,54.93 32.78,55.09 v32.94,55.09
N$35
  Top 0.203: C20.1 R43.1 27.5,67.94 | 27.5,67.94 R44.2 | IC5.2 24.07,68.17 R42.2 24.86,67.94 27.5,67.94
N$36  (via drill 0.3)
  Top 0.203: IC5.1 24.72,65.84 v24.99,65.56 C20.2 R43.2 | v25.31,64.26 25.79,63.78 25.79,61.63 R45.1
  Bottom 0.203: v25.31,64.26 24.99,64.57 v24.99,65.56
N$37
  Top 0.203: R46.1 27.5,60.64 | 27.5,60.64 R45.2 | IC5.13 24.07,62.1 24.2,62.23 24.99,62.23 25.15,62.07 25.15,60.8 25.31,60.64 27.5,60.64
N$38
  Top 0.203: IC5.14 24.72,60.18 R47.1 24.39,59.85 R46.2
N$39
  Top 0.203: IC7.8 24.04,70.29 R42.1
N$40
  Top 0.203: J12.TIP_T@3 9.75,27.49 8.2,29.04 8.2,31.96 9.39,33.15 9.39,39.85 7.85,41.39 7.85,44.61 12.2,48.96 17.85,48.96 19,50.11 19,56.58 19.59,57.17 23.9,57.17 24.36,57.63 R47.2
N$41
  Top 0.203: C21.1 R49.1 18.04,67.94 | 18.04,67.94 R50.2 | IC5.6 21.47,68.17 R48.2 20.67,67.94 18.04,67.94
N$42
  Top 0.203: C21.2 19.72,65.41 19.72,61.59 R51.1 | R49.2 C21.2 | IC5.7 20.82,65.84 20.55,65.56 C21.2
N$43
  Top 0.203: R52.1 18.04,60.64 | 18.04,60.64 R51.2 | IC5.9 21.5,61.25 21.5,62.07 21.34,62.23 20.55,62.23 20.39,62.07 20.39,60.8 20.23,60.64 18.04,60.64
N$44
  Top 0.203: IC5.8 20.82,60.18 R53.1 21.15,59.85 R52.2
N$45
  Top 0.203: IC7.6 21.5,70.29 R48.1
N$46
  Top 0.203: J13.TIP_T@3 9.75,14.99 8.2,16.54 8.2,19.46 9.39,20.65 9.39,27.35 7.85,28.89 7.85,32.11 9.04,33.3 9.04,39.7 7.49,41.25 7.49,44.75 12.05,49.31 17.69,49.31 18.65,50.27 18.65,56.72 19.45,57.52 21.02,57.52 21.18,57.68 R53.2
N$47
  Top 0.203: R69.1 7.53,80.52 7.53,78.58 6.74,77.79 6.26,77.79 5.62,77.15 5.62,74.43 S4.LEDPOS
N$48
  Top 0.203: R68.1 6.25,96.08 S3.LEDPOS
N$49
  Top 0.203: T5.B R55.1
N$50  (via drill 0.3)
  Top 0.203: J14.TIP_T@3 13.25,45.5 12.74,46.01 11.17,46.01 v11.11,46.07 | R56.1 6.29,93.19 T5.C 1.41,93.19 0.93,92.71 0.93,79.62 1.28,79.27 1.28,78.81 0.93,78.46 0.93,49.16 1.83,48.26 9.08,48.26 v9.64,47.7
  Bottom 0.203: v9.64,47.7 9.8,47.54 10.44,47.54 10.95,47.02 10.95,46.23 v11.11,46.07
N$51
  Top 0.203: R54.1 24,8.9 D3.-
N$52
  Top 0.203: R67.1 53.6,79.05 S2.LEDPOS
N$53
  Top 0.203: T6.B R58.1
N$54  (via drill 0.3)
  Top 0.203: J15.TIP_T@3 13.25,39.99 14.8,41.54 14.8,44.46 12.81,46.44 11.81,46.44 v11.65,46.61 | R59.1 6.29,90.01 T6.C 1.77,90.01 1.29,89.53 1.29,79.76 1.63,79.42 1.63,78.66 1.29,78.32 1.29,49.31 1.98,48.62 9.8,48.62 v10.18,48.24
  Bottom 0.203: v10.18,48.24 10.34,48.24 11.65,46.93 v11.65,46.61
N$55
  Top 0.203: S1.LEDPOS 54.01,102.44 R66.1
N$57
  Top 0.203: T7.B R61.1
N$58  (via drill 0.3)
  Top 0.203: J16.TIP_T@3 13.25,27.49 14.8,29.04 14.8,31.96 13.61,33.15 13.61,39.85 15.15,41.39 15.15,44.61 12.64,47.12 12.22,47.12 v12.19,47.15 | R62.1 6.29,86.84 T7.C 2.12,86.84 1.65,86.36 1.65,79.91 1.99,79.57 1.99,78.51 1.65,78.17 1.65,49.46 2.13,48.97 10.53,48.97 v10.72,48.77
  Bottom 0.203: v12.19,47.15 12.03,47.15 10.72,48.45 v10.72,48.77
N$59
  Top 0.203: D6.- 24,46.52 R63.1
N$61
  Top 0.203: T8.B R64.1
N$62  (via drill 0.3)
  Top 0.203: J17.TIP_T@3 13.25,14.99 14.8,16.54 14.8,19.46 13.61,20.65 13.61,27.35 15.15,28.89 15.15,32.11 13.96,33.3 13.96,39.7 15.51,41.25 15.51,44.75 12.72,47.54 v12.72,47.69 | R65.1 6.29,83.66 T8.C 2.32,83.66 2,83.34 2,80.06 2.35,79.71 2.35,78.37 2,78.02 2,49.6 2.28,49.33 10.48,49.33 10.49,49.33 11.24,49.33 v11.26,49.31
  Bottom 0.203: v12.72,47.69 12.57,47.85 11.93,47.85 11.42,48.36 11.42,49.16 v11.26,49.31
N$65
  Top 0.203: R57.1 24,21.6 D4.-
N$67
  Top 0.203: D5.- 24.75,36.23 R60.1
N$80  (via drill 0.3)
  Top 0.203: IC9.14 28.17,48.26 28.48,48.58 30.79,48.58 31.27,49.05 31.27,57.97 29.42,59.81 29.42,73.81 29.26,73.98 17.5,73.98 14.51,76.97 14.51,83.62 v14.31,83.82 | IC8.9 v15.78,83.82
  Bottom 0.203: v14.31,83.82 14.47,83.66 15.62,83.66 v15.78,83.82
N$81
  Top 0.203: D11.- 36,8.96 R74.1
N$82
  Top 0.203: D12.- 36,21.5 R75.1
N$83
  Top 0.203: R76.1 35.09,36.39 D13.-
N$84
  Top 0.203: D14.- 36,46.59 R77.1
OSC1
  Top 0.203: C27.1 26.13,78.23 X1.2 27.05,78.42 27.76,79.12 27.76,82.23 28.07,82.55 29.12,82.55 29.38,82.81 IC2.5
OSC2
  Top 0.203: IC2.6 29.88,82.8 29.27,82.19 28.23,82.19 28.11,82.07 28.11,79.11 28.8,78.42 X1.1 30.83,78.23 C26.1
POT1
  Top 0.203: IC2.13 35.3,85.55 36.2,84.64 36.2,81.03 38.7,78.54 43.11,78.54 43.55,78.09 43.55,74.92 41.98,73.34 41.98,70.71 43.76,68.93 C35.2 43.76,65.4 44.27,64.89 44.27,64.48 R5.P$2
POT2  (via drill 0.3)
  Top 0.203: R10.P$2 38.31,56.81 38.97,56.81 39.62,57.47 41.47,57.47 C36.2 43.91,59.91 43.91,64.74 42.96,65.69 42.96,69.22 41.62,70.56 41.62,73.49 43.2,75.06 43.2,77.94 42.96,78.18 38.55,78.18 35.85,80.88 35.85,83.62 35.65,83.83 v35.65,84.11 | IC2.12 32.88,82.76 33.09,82.55 33.98,82.55 34.22,82.79 v34.22,82.95
  Bottom 0.203: v35.65,84.11 35.39,84.11 v34.22,82.95
POT3  (via drill 0.3)
  Top 0.203: v18.74,57.61 18.69,57.61 C37.2 16.34,59.96 16.34,64.85 17.34,65.85 17.34,69.22 19.24,71.12 v19.49,71.12 | IC2.11 32.38,83.11 32.23,82.96 32.23,75.16 31.21,74.14 v31.1,74.14 | v24.77,71.12 28.91,71.12 29.07,71.28 29.07,73.22 v28.86,73.42
  Bottom 0.203: R15.P$2 21.14,57.61 v18.74,57.61 | v31.1,74.14 31.1,73.98 30.54,73.42 v28.86,73.42 | v24.77,71.12 24.62,71.28 19.65,71.28 v19.49,71.12
POT4  (via drill 0.3)
  Top 0.203: R20.P$2 15.98,64.48 15.98,65 16.55,65.56 C38.2 16.55,68.93 18.64,71.03 18.64,71.28 19.24,71.88 v19.49,71.88 | v24.77,71.88 24.86,71.88 25.27,71.48 28.59,71.48 28.71,71.6 28.71,72.64 28.1,73.25 v28.1,73.42 | v30.75,74.86 31.43,74.86 31.88,75.31 IC2.10
  Bottom 0.203: v28.1,73.42 28.1,73.6 28.48,73.98 29.1,73.98 29.3,73.77 30.23,73.77 30.54,74.08 30.54,74.53 30.75,74.73 v30.75,74.86 | v19.49,71.88 19.62,71.88 19.87,71.63 24.36,71.63 24.6,71.88 v24.77,71.88
RCK595  (via drill 0.3)
  Top 0.203: IC9.12 30.71,47.94 31.62,48.86 31.62,58.11 29.78,59.95 29.78,73.96 29.41,74.33 17.65,74.33 14.87,77.11 14.87,86.72 15.78,87.63 IC8.12 19.6,87.63 v20.31,88.34 | IC2.40 21.48,89.55 21.36,89.67 20.61,89.67 v20.59,89.65
  Bottom 0.203: v20.59,89.65 20.59,89.36 20.57,89.34 20.57,88.6 v20.31,88.34
RESET  (via drill 0.3)
  Top 0.203: R73.1 16.29,55.18 K1.4 | K1.1 K1.4 | IC2.7 30.38,82.8 29.41,81.84 28.87,81.84 v28.67,81.64 | v24.98,79.14 24.98,75.91 v25.23,75.65 | v25.15,73.42 24.95,73.62 18.92,73.62 18.41,73.11 v18.41,71.83 | v14.19,68.58 13.72,68.11 13.72,60.17 14.2,59.69 K1.4
  Bottom 0.203: v28.67,81.64 26.18,79.14 v24.98,79.14 | v25.23,75.65 25.23,73.5 v25.15,73.42 | v18.41,71.83 18.41,70.57 16.42,68.58 v14.19,68.58
SCK1
  Top 0.203: IC2.26 32.38,91.23 31.73,90.58 31.73,86.74 35.14,83.33 35.14,80.59 37.69,78.04 IC6.3
SCK2  (via drill 0.3)
  Top 0.203: IC2.39 21.26,90.05 v21.09,90.23 | IC7.3 21.5,78.11 20.58,79.02 20.58,85.95 21.8,87.17 v21.8,87.49
  Bottom 0.203: v21.09,90.23 21.09,89.94 21.69,89.34 21.69,87.61 v21.8,87.49
SCK595
  Top 0.203: IC9.11 31.98,58.26 30.14,60.1 30.14,74.11 29.55,74.69 17.8,74.69 15.22,77.26 15.22,85.96 15.62,86.36 IC8.11 19.12,86.36 20.81,88.05 IC2.43
SCL  (via drill 0.3)
  Top 0.203: IC2.45 25.02,87.05 24.91,86.93 24.16,86.93 v24,87.09 | v23.12,91.11 23.12,91.27 22.32,92.07 22.32,94.5 26.67,98.86 26.67,99.95 27.73,101 U$44.P$3 28.86,102.63 R70.2
  Bottom 0.203: v23.12,91.11 22.96,90.95 22.96,88.78 23.88,87.86 23.88,87.2 v24,87.09
SDA  (via drill 0.3)
  Top 0.203: IC2.46 24.39,86.55 24.2,86.36 23.78,86.36 23.32,86.81 v23.32,87.49 | R71.2 24.67,101 U$44.P$4 26.32,99 21.96,94.65 21.96,91.51 v22.36,91.11
  Bottom 0.203: v23.32,87.49 23.32,87.65 22.49,88.49 22.49,89.55 22.36,89.67 v22.36,91.11
SER595
  Top 0.203: IC2.42 20.9,88.55 19.28,90.17 IC8.14
SWCLK  (via drill 0.3)
  Top 0.203: v26.09,97.49 25.8,97.49 22.67,94.36 22.67,92.35 23.97,91.05 IC2.37 | JP1.3 21.82,100.65 21.98,100.49 21.98,98.62 22.13,98.46 24.77,98.46 24.99,98.69 v24.99,98.98
  Bottom 0.203: v24.99,98.98 25.15,98.98 25.95,98.18 25.95,97.63 v26.09,97.49
SWDIO  (via drill 0.3)
  Top 0.203: IC2.34 28.38,96.43 28.17,96.64 27.53,96.64 26.83,97.34 26.83,97.82 v26.63,98.03 | JP1.2 24.92,98.11 25.76,98.95 v25.76,99.23
  Bottom 0.203: v25.76,99.23 25.76,98.92 26.63,98.04 v26.63,98.03
USB+
  Top 0.203: IC2.33 28.88,96.76 28.64,97 27.69,97 27.53,97.16 R9.2
USB+2
  Top 0.203: R9.1 28.23,100.04 29.6,100.04 29.95,99.7 32.12,99.7 32.41,100 32.41,103.81 33.73,105.13 55.46,105.13 55.94,104.65 57.05,104.65 58.56,103.14 58.56,94.55 55.85,91.83 X2.3 57.42,89.5 R72.1
USB-
  Top 0.203: IC2.32 29.38,97.57 R4.2
USB-2
  Top 0.203: X2.2 53.02,89.5 58.21,94.69 58.21,102.99 56.9,104.3 55.79,104.3 55.31,104.78 33.88,104.78 32.77,103.66 32.77,99.85 32.26,99.35 R4.1